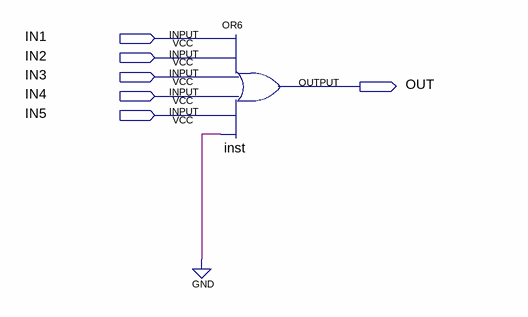
[diagram p0: schematic sheet]
// Quartus schematic or5.bdf as structural Verilog: 1 symbols, 6 pins
module or5 (
  input  IN1,
  input  IN2,
  input  IN3,
  input  IN4,
  input  IN5,
  output OUT
);

  or inst (OUT, IN1, IN2, IN3, IN4, IN5, 1'b0);
endmodule
